# Altium schematic sheet Power.SchDoc: Power
size A; DrawnBy: Jun Zhang; Revision: A; SheetNumber: 4; SheetTotal: 4
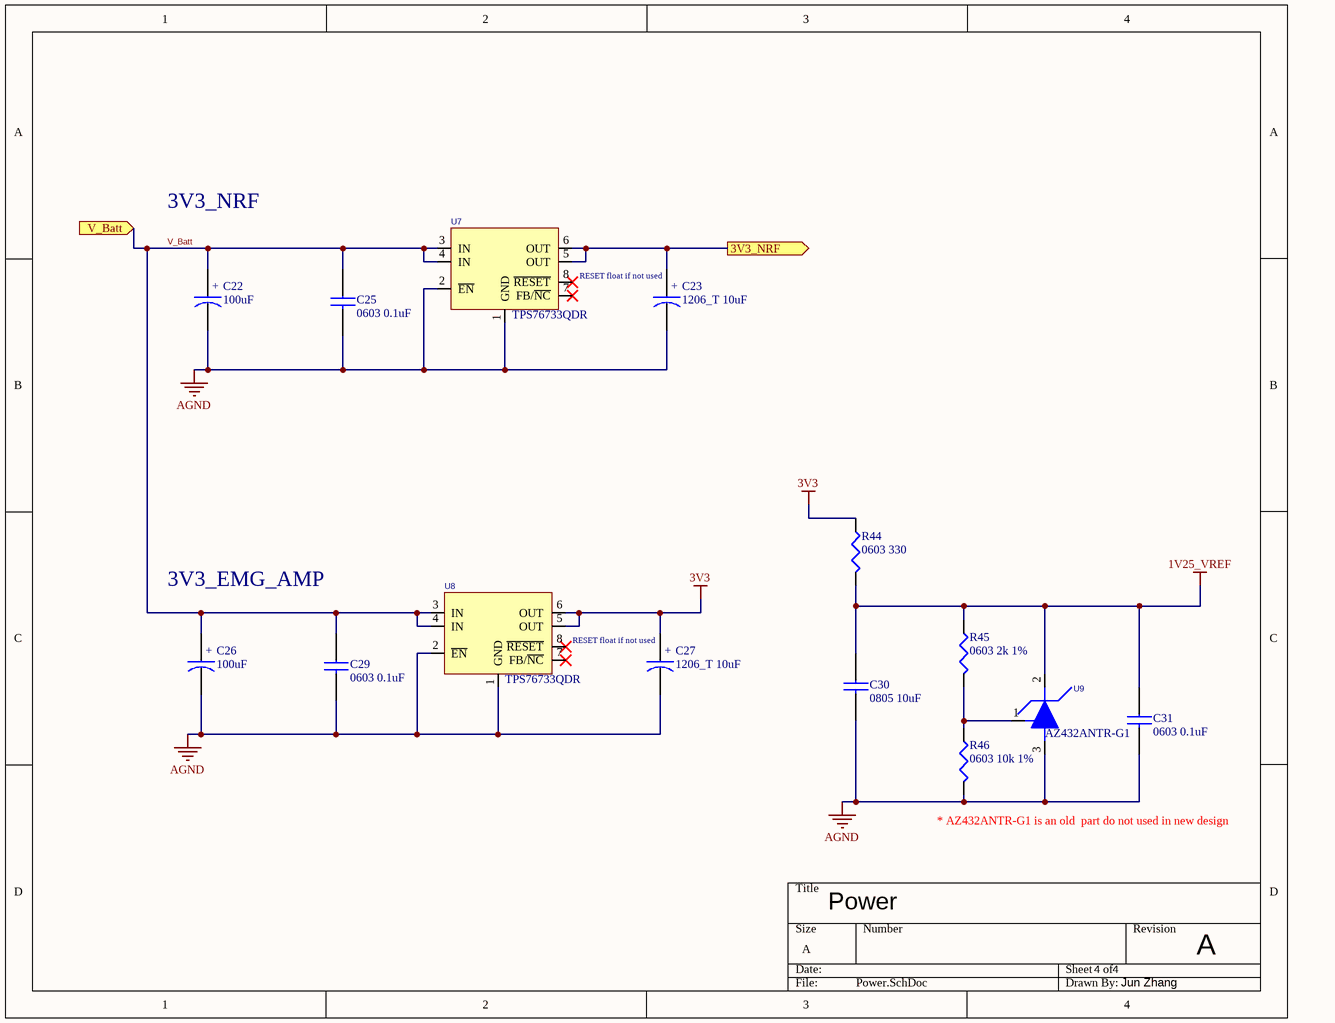
[diagram p0: Power.SchDoc]

## Parts
C22  100uF  [CAPAE7866X61M]
C23  1206_T 10uF  [CAP_1206_TANT]
C25  0603 0.1uF  [CAP_0603_CER]
C26  100uF  [CAPAE7866X61M]
C27  1206_T 10uF  [CAP_1206_TANT]
C29  0603 0.1uF  [CAP_0603_CER]
C30  0805 10uF  [CAP_0805_CER]
C31  0603 0.1uF  [CAP_0603_CER]
R44  0603 330  [0603]
R45  0603 2k 1%  [0603]
R46  0603 10k 1%  [0603]
U7  TPS76733QDR  [SOIC127P600X175-8N]
U8  TPS76733QDR  [SOIC127P600X175-8N]
U9  AZ432ANTR-G1  [SOT95P245X110-3N]

## Ports
3V3_NRF (out), V_Batt (in)

## Nets
1V25_VREF: C30.1 C31.1 R44.2 R45.1 U9.2(Cathode)
3V3: C27.1 R44.1 U8.5(OUT) U8.6(OUT)
AGND: C22.2 C23.2 C25.2 C26.2 C27.2 C29.2 C30.2 C31.2 R46.2 U7.1(GND) U7.2(~{EN}) U8.1(GND) U8.2(~{EN}) U9.3(Anode)
3V3_NRF: C23.1 U7.5(OUT) U7.6(OUT) ; port 3V3_NRF
V_Batt: C22.1 C25.1 C26.1 C29.1 U7.3(IN) U7.4(IN) U8.3(IN) U8.4(IN) ; port V_Batt
NetR45_2: R45.2 R46.1 U9.1(REF)

Not connected (* = marked no-connect by the designer): U7 7(FB/~{NC})* 8(~{RESET})*; U8 7(FB/~{NC})* 8(~{RESET})*

## Notes on the sheet
- 3V3_NRF
- RESET float if not used
- 3V3_EMG_AMP
- (near R46) * AZ432ANTR-G1 is an old  part do not used in new design
- (in symbol CAP_POL) +

## Library data of the parts
C22 C26 = CAP_POL: Electrolytic 100uF; Manufacturer Part Number: AFK107M16D16T-F; Manufacturer: Cornell Dubilier Electronics (CDE); Capacitance: 100uF; Dielectric: *; Package: CAPAE; Supplier 1: Digi-Key; Supplier Part Number 1: 338-2140-1-ND
C23 C27 = CAP_POL: Tantalum CAP / ESR: 900mOhm / Rated: 10V; Manufacturer Part Number: TPSA106K010R0900; Manufacturer: KYOCERA AVX; Tolerance: +/- 10%; Capacitance: 10uF; Dielectric: *; Package: 1206; Supplier 1: Digi-Key; Supplier Part Number 1: 478-1751-1-ND; ESR: 900m Ohm
C25 C29 = CAP_NP: Generic Cap for NC (No Polar) / ESR <30mOhm / ESL <1.5nH, / X7R; Manufacturer: KYOCERA AVX; Manufacturer Part Number: 06033C104K4T4A; ComponentLink1Description: New link; ComponentLink1URL: *; Capacitance: 0.1uF; Package: 0603; Dielectric: X7R; Supplier 1: Digi-Key; Supplier Part Number 1: 478-10673-1-ND
C30 = CAP_NP: Generic Cap for NC (No Polar) / ESR <30mOhm / ESL <1.5nH, / X7R; Manufacturer: KEMET; Manufacturer Part Number: C0805C106M8RACTU; ComponentLink1Description: New link; ComponentLink1URL: *; Capacitance: 10uF; Package: 0603; Dielectric: X7R
C31 = CAP_NP: Generic Cap for NC (No Polar) / ESR <30mOhm / ESL <1.5nH, / X7R; Manufacturer: KEMET; Manufacturer Part Number: C0603C104K5RAC7867; ComponentLink1Description: New link; ComponentLink1URL: *; Capacitance: 0.1uF; Package: 0603; Dielectric: X7R
R44 = RESISTOR: Generic Resistor; Resistance: 330; Manufacturer Part Number: *; Manufacturer: *; Package: 0603
R45 R46 = RESISTOR: Generic Resistor; Manufacturer: YAGEO; Manufacturer Part Number: *; Package: 0603
  R45: Resistance: 2k
  R46: Resistance: 10k
U7 U8 = TPS76733QDR: IC REG LDO 3.3V 1A 8SOIC / LDO Regulator Pos 3.3V 1A 8-Pin SOIC T/R; Manufacturer: Texas Instruments; Number of Outputs: 1; Max Power Dissipation: 904mW; Dropout Voltage: 350mV; Max Input Voltage: 10V; Min Input Voltage: 2.7V; Input Bias Current: 85uA; Min Current Limit: 1.2A; Polarity: Positive; Quiescent Current: 80uA; Output Voltage Accuracy: 2%; Output Type: Fixed; Supplier 1: Arrow Electronics; Supplier Part Number 1: TPS76733QDR; Manufacturer Part Number: TPS76733QDR; RoHS: Yes; Category: Voltage Regulators - Linear; Case/Package: D; Number of Pins: 8; Min Operating Temperature: -40°C; Max Operating Temperature: 125°C; Package Quantity: 2500; Output Current: 1A; Output Voltage: 3.3V; Packaging: Tape and Reel; Max Output Current: 1A; Number of Regulators: 1; Power Dissipation: 904mW; Accuracy: 2%; Max Output Voltage: 3.3V; Min Output Voltage: 3.3V; Series: -; Lead Free: Lead Free; RoHS Compliant: Yes; ComponentLink1URL: https://datasheet.ciiva.com/26909/tps76733qdr-26909024.pdf?src-supplier=IIIC; ComponentLink1Description: https://datasheet.ciiva.com/26909/tps76733qdr-26909024.pdf?src-supplier=IIIC; ComponentLink2URL: https://datasheet.ciiva.com/2064/tps76701-2064275.pdf?src-supplier=Digi-Key; ComponentLink2Description: https://datasheet.ciiva.com/2064/tps76701-2064275.pdf?src-supplier=Digi-Key; ComponentLink3URL: https://datasheet.ciiva.com/14275/tps76701-14275656.pdf?src-supplier=Avnet; ComponentLink3Description: https://datasheet.ciiva.com/14275/tps76701-14275656.pdf?src-supplier=Avnet
U9 = AZ432ANTR-G1: V-Ref Adjustable/Precision/Programmable 1.25V to 18V 100mA 3-Pin SOT-23 T/R; Manufacturer: Diodes; Temperature Coefficient: 20ppm/°C; Cathode Current: 80uA; Tolerance: 0.5%; Reference Type: Shunt; Supplier 1: Digi-Key; Supplier Part Number 1: AZ432ANTR-G1DICT-ND; Manufacturer Part Number: AZ432ANTR-G1; RoHS: Yes; Category: Voltage References; Stock 1: 92; Pricing 1: 1=0.49000, 10=0.37200, 25=0.33600, 100=0.23200, 250=0.19536, 500=0.15874, 1000=0.12211 (USD); Mount: Surface Mount; Case/Package: TO-236-3; Min Operating Temperature: -40°C; Max Operating Temperature: 125°C; Max Input Voltage: 18V; Max Output Current: 100mA; Packaging: Tape and Reel; Output Voltage: 18V; Min Output Voltage: 1.25V; Max Output Voltage: 18V; Output Current: 100mA; Output Type: Adjustable; Radiation Hardening: No; RoHS Compliant: Yes; ComponentLink1URL: http://www.diodes.com/datasheets/AZ432.pdf?src-supplier=Avnet; ComponentLink1Description: http://www.diodes.com/datasheets/AZ432.pdf?src-supplier=Avnet; ComponentLink2URL: https://www.diodes.com/assets/Datasheets/AZ432.pdf?src-supplier=Digi-Key; ComponentLink2Description: https://www.diodes.com/assets/Datasheets/AZ432.pdf?src-supplier=Digi-Key